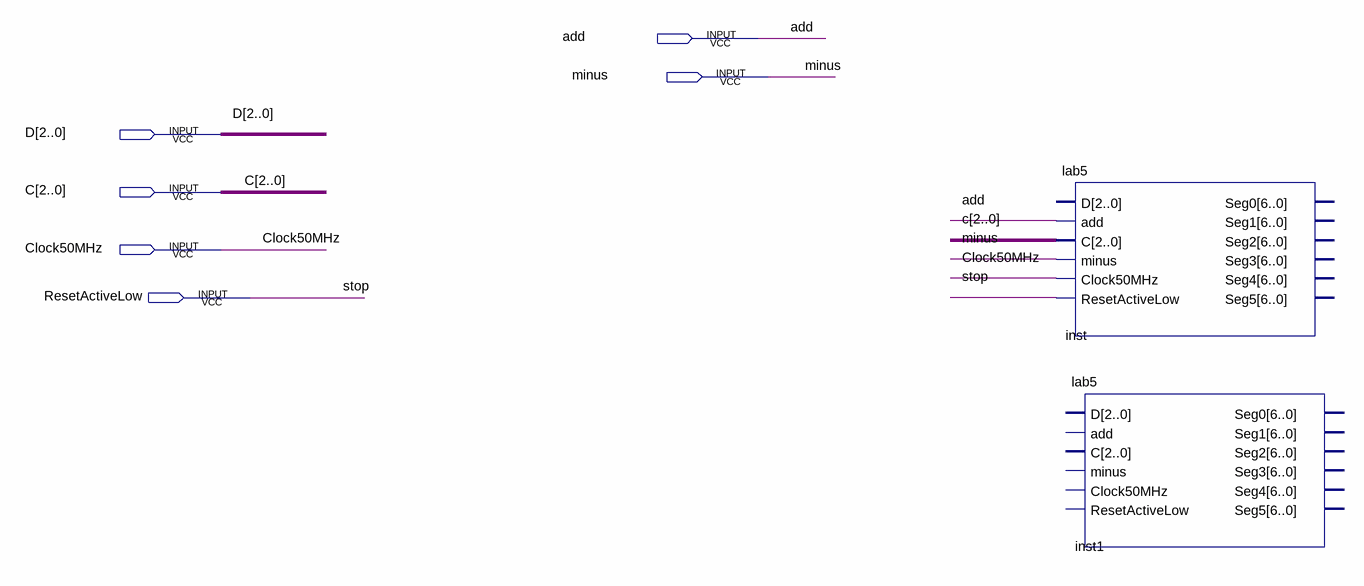
[diagram p0: schematic sheet]
// Quartus schematic Lab5V5.bdf as structural Verilog: 2 symbols, 6 pins
module Lab5V5 (
  input  add,
  input  minus,
  input  [2:0] D,
  input  [2:0] C,
  input  Clock50MHz,
  input  ResetActiveLow
);

  lab5 inst (
    .add(add), .C(C), .minus(minus), .Clock50MHz(Clock50MHz), .ResetActiveLow(ResetActiveLow));  // open: D, Seg0, Seg1, Seg2, Seg3, Seg4, Seg5
  lab5 inst1 ();  // open: D, add, C, minus, Clock50MHz, ResetActiveLow, Seg0, Seg1, Seg2, Seg3, Seg4, Seg5

  // Other names for the same wires on the sheet: stop = ResetActiveLow
endmodule
